# EAGLE design And_Or (EAGLE 7.6.0)
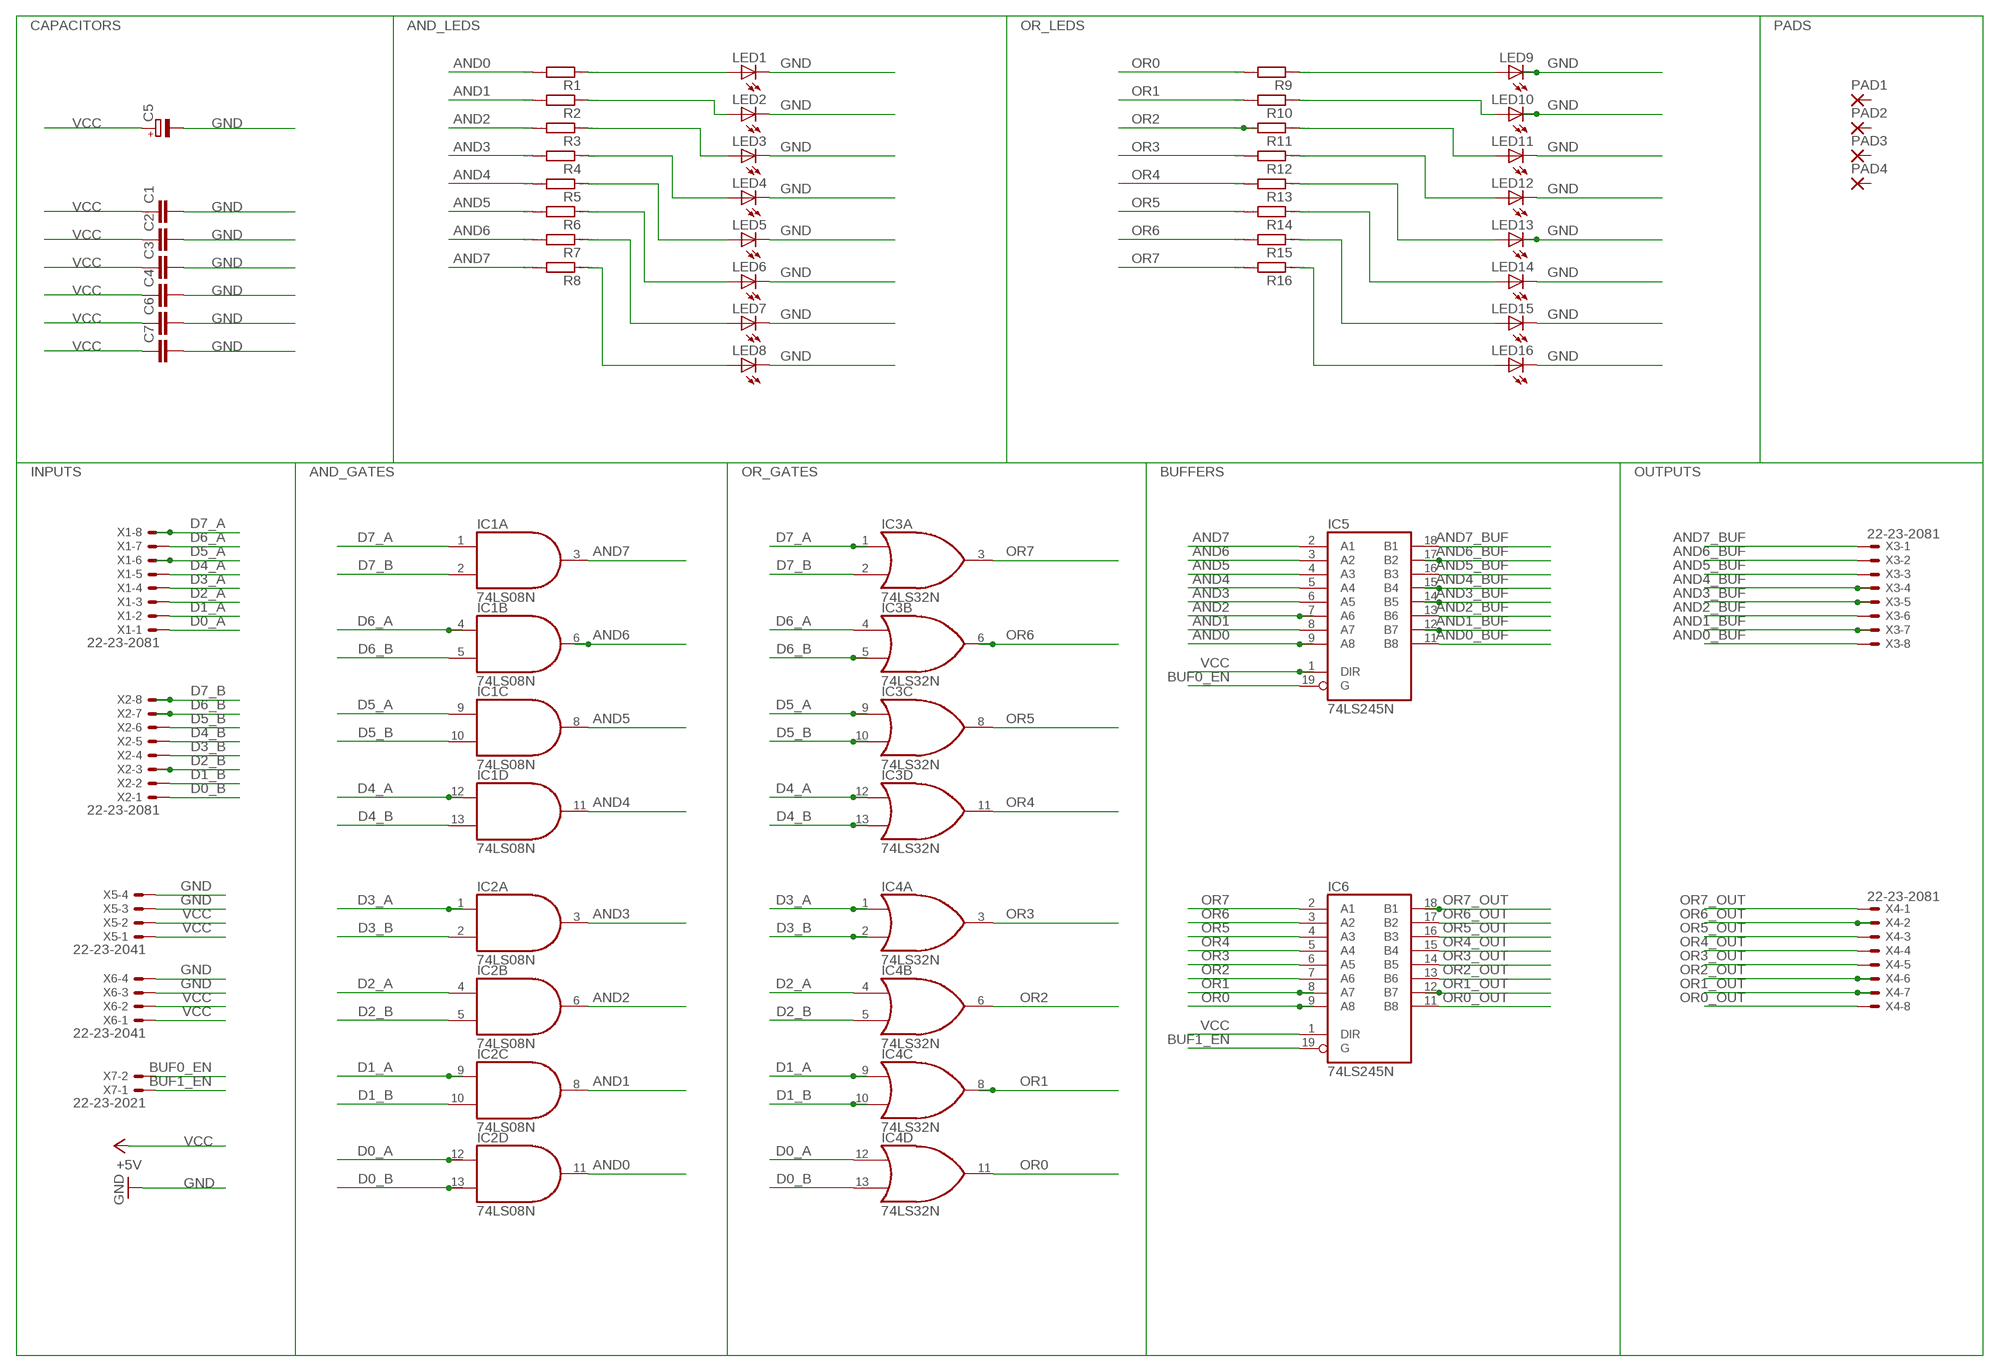
[diagram p0: schematic, sheet 1]

## Parts
C1  C-EU025-025X050  [C025-025X050]
C2  C-EU025-025X050  [C025-025X050]
C3  C-EU025-025X050  [C025-025X050]
C4  C-EU025-025X050  [C025-025X050]
C5  CPOL-EUE2,5-6E  [E2,5-6E]
C6  C-EU025-025X050  [C025-025X050]
C7  C-EU025-025X050  [C025-025X050]
IC1  74LS08N  [DIL14]
IC2  74LS08N  [DIL14]
IC3  74LS32N  [DIL14]
IC4  74LS32N  [DIL14]
IC5  74LS245N  [DIL20]
IC6  74LS245N  [DIL20]
LED1  LED5MM  [LED5MM]
LED2  LED5MM  [LED5MM]
LED3  LED5MM  [LED5MM]
LED4  LED5MM  [LED5MM]
LED5  LED5MM  [LED5MM]
LED6  LED5MM  [LED5MM]
LED7  LED5MM  [LED5MM]
LED8  LED5MM  [LED5MM]
LED9  LED5MM  [LED5MM]
LED10  LED5MM  [LED5MM]
LED11  LED5MM  [LED5MM]
LED12  LED5MM  [LED5MM]
LED13  LED5MM  [LED5MM]
LED14  LED5MM  [LED5MM]
LED15  LED5MM  [LED5MM]
LED16  LED5MM  [LED5MM]
PAD1  3,17/1,3  [3,17/1,3]
PAD2  3,17/1,3  [3,17/1,3]
PAD3  3,17/1,3  [3,17/1,3]
PAD4  3,17/1,3  [3,17/1,3]
R1  R0207/10  [0207/10]
R2  R0207/10  [0207/10]
R3  R0207/10  [0207/10]
R4  R0207/10  [0207/10]
R5  R0207/10  [0207/10]
R6  R0207/10  [0207/10]
R7  R0207/10  [0207/10]
R8  R0207/10  [0207/10]
R9  R0207/10  [0207/10]
R10  R0207/10  [0207/10]
R11  R0207/10  [0207/10]
R12  R0207/10  [0207/10]
R13  R0207/10  [0207/10]
R14  R0207/10  [0207/10]
R15  R0207/10  [0207/10]
R16  R0207/10  [0207/10]
X1  22-23-2081  [22-23-2081]
X2  22-23-2081  [22-23-2081]
X3  22-23-2081  [22-23-2081]
X4  22-23-2081  [22-23-2081]
X5  22-23-2041  [22-23-2041]
X6  22-23-2041  [22-23-2041]
X7  22-23-2021  [22-23-2021]

## Nets
AND0: IC2.11(D:O) IC5.9(A8) R1.2
AND0_BUF: IC5.11(B8) X3.8
AND1: IC2.8(C:O) IC5.8(A7) R2.2
AND1_BUF: IC5.12(B7) X3.7
AND2: IC2.6(B:O) IC5.7(A6) R3.2
AND2_BUF: IC5.13(B6) X3.6
AND3: IC2.3(A:O) IC5.6(A5) R4.2
AND3_BUF: IC5.14(B5) X3.5
AND4: IC1.11(D:O) IC5.5(A4) R5.2
AND4_BUF: IC5.15(B4) X3.4
AND5: IC1.8(C:O) IC5.4(A3) R6.2
AND5_BUF: IC5.16(B3) X3.3
AND6: IC1.6(B:O) IC5.3(A2) R7.2
AND6_BUF: IC5.17(B2) X3.2
AND7: IC1.3(A:O) IC5.2(A1) R8.2
AND7_BUF: IC5.18(B1) X3.1
BUF0_EN: IC5.19(G) X7.2
BUF1_EN: IC6.19(G) X7.1
D0_A: IC2.12(D:I0) IC4.12(D:I0) X1.1
D0_B: IC2.13(D:I1) IC4.13(D:I1) X2.1
D1_A: IC2.9(C:I0) IC4.9(C:I0) X1.2
D1_B: IC2.10(C:I1) IC4.10(C:I1) X2.2
D2_A: IC2.4(B:I0) IC4.4(B:I0) X1.3
D2_B: IC2.5(B:I1) IC4.5(B:I1) X2.3
D3_A: IC2.1(A:I0) IC4.1(A:I0) X1.4
D3_B: IC2.2(A:I1) IC4.2(A:I1) X2.4
D4_A: IC1.12(D:I0) IC3.12(D:I0) X1.5
D4_B: IC1.13(D:I1) IC3.13(D:I1) X2.5
D5_A: IC1.9(C:I0) IC3.9(C:I0) X1.6
D5_B: IC1.10(C:I1) IC3.10(C:I1) X2.6
D6_A: IC1.4(B:I0) IC3.4(B:I0) X1.7
D6_B: IC1.5(B:I1) IC3.5(B:I1) X2.7
D7_A: IC1.1(A:I0) IC3.1(A:I0) X1.8
D7_B: IC1.2(A:I1) IC3.2(A:I1) X2.8
GND [supply]: C1.2 C2.2 C3.2 C4.2 C5.- C6.2 C7.2 LED1.K(C) LED2.K(C) LED3.K(C) LED4.K(C) LED5.K(C) LED6.K(C) LED7.K(C) LED8.K(C) LED9.K(C) LED10.K(C) LED11.K(C) LED12.K(C) LED13.K(C) LED14.K(C) LED15.K(C) LED16.K(C) X5.3 X5.4 X6.3 X6.4
N$35: LED1.A R1.1
N$36: LED2.A R2.1
N$37: LED3.A R3.1
N$38: LED4.A R4.1
N$39: LED5.A R5.1
N$40: LED6.A R6.1
N$41: LED8.A R8.1
N$42: LED7.A R7.1
N$59: LED16.A R16.1
N$60: LED15.A R15.1
N$61: LED14.A R14.1
N$62: LED13.A R13.1
N$63: LED12.A R12.1
N$64: LED11.A R11.1
N$65: LED10.A R10.1
N$66: LED9.A R9.1
OR0: IC4.11(D:O) IC6.9(A8) R9.2
OR0_OUT: IC6.11(B8) X4.8
OR1: IC4.8(C:O) IC6.8(A7) R10.2
OR1_OUT: IC6.12(B7) X4.7
OR2: IC4.6(B:O) IC6.7(A6) R11.2
OR2_OUT: IC6.13(B6) X4.6
OR3: IC4.3(A:O) IC6.6(A5) R12.2
OR3_OUT: IC6.14(B5) X4.5
OR4: IC3.11(D:O) IC6.5(A4) R13.2
OR4_OUT: IC6.15(B4) X4.4
OR5: IC3.8(C:O) IC6.4(A3) R14.2
OR5_OUT: IC6.16(B3) X4.3
OR6: IC3.6(B:O) IC6.3(A2) R15.2
OR6_OUT: IC6.17(B2) X4.2
OR7: IC3.3(A:O) IC6.2(A1) R16.2
OR7_OUT: IC6.18(B1) X4.1
VCC [supply]: C1.1 C2.1 C3.1 C4.1 C5.+ C6.1 C7.1 IC5.1(DIR) IC6.1(DIR) X5.1 X5.2 X6.1 X6.2 ; supply symbol labelled +5V
Unconnected: PAD1.1(P) PAD2.1(P) PAD3.1(P) PAD4.1(P)

## Notes on the sheet
- CAPACITORS | AND_LEDS | OR_LEDS | PADS
- INPUTS | AND_GATES | OR_GATES | BUFFERS | OUTPUTS

## Power pins joined to a net without a drawn wire
GND: IC1.7(P:GND) IC2.7(P:GND) IC3.7(P:GND) IC4.7(P:GND) IC5.10(GND) IC6.10(GND)
VCC: IC1.14(P:VCC) IC2.14(P:VCC) IC3.14(P:VCC) IC4.14(P:VCC) IC5.20(VCC) IC6.20(VCC)

## Library data of the parts
C1-C4 C6 C7 = rcl:C-EU: CAPACITOR, European symbol
C5 = rcl:CPOL-EU: POLARIZED CAPACITOR, European symbol
IC1 IC2 = 74xx-us:74*08: Quad 2-input AND gate
IC3 IC4 = 74xx-us:74*32: Quad 2-input OR gate
IC5 IC6 = 74xx-us:74*245: Octal BUS TRANSCEIVER, 3-state
LED1-LED16 = led:LED: LED OSRAM: - CHIPLED LG R971, LG N971, LY N971, LG Q971, LY Q971, LO R971, LY R971 LH N974, LH R974 LS Q976, LO Q976, LY Q976 LO Q996 - Hyper CHIPLED LW Q18S LB Q993, LB Q99A, LB R99A - SideLED LS A670, LO A670, LY A670, LG A670, LP A670 LB A673, LV A673, LT A673, LW A673 LH A674 LY A675 LS A676, LA A676, LO A676, LY A676, LW A676 LS A679, LY A679, LG A679 - Hyper Micro SIDELED® LS Y876, LA Y876, LO Y876, LY Y876 LT Y87S - SmartLED LW L88C, LW L88S LB L89C, LB L89S, LG L890 LS L89K, LO L89K, LY L89K LS L896, LA L896, LO L896, LY L896 - TOPLED LS T670, LO T670, LY T670, LG T670, LP T670 LSG T670, LSP T670, LSY T670, LOP T670, LYG T670 LG T671, LOG T671, LSG T671 LB T673, LV T673, LT T673, LW T673 LH T674 LS T676, LA T676, LO T676, LY T676, LB T676, LH T676, LSB T676, LW T676 LB T67C, LV T67C, LT T67C, LS T67K, LO T67K, LY T67K, LW E67C LS E67B, LA E67B, LO E67B, LY E67B, LB E67C, LV E67C, LT E67C LW T67C LS T679, LY T679, LG T679 LS T770, LO T770, LY T770, LG T770, LP T770 LB T773, LV T773, LT T773, LW T773 LH T774 LS E675, LA E675, LY E675, LS T675 LS T776, LA T776, LO T776, LY T776, LB T776 LHGB T686 LT T68C, LB T68C - Hyper Mini TOPLED® LB M676 - Mini TOPLED Santana® LG M470 LS M47K, LO M47K, LY M47K Source: http://www.osram.convergy.de LUXEON: - LUMILED® LXK2-PW12-R00, LXK2-PW12-S00, LXK2-PW14-U00, LXK2-PW14-V00 LXK2-PM12-R00, LXK2-PM12-S00, LXK2-PM14-U00 LXK2-PE12-Q00, LXK2-PE12-R00, LXK2-PE12-S00, LXK2-PE14-T00, LXK2-PE14-U00 LXK2-PB12-K00, LXK2-PB12-L00, LXK2-PB12-M00, LXK2-PB14-N00, LXK2-PB14-P00, LXK2-PB14-Q00 LXK2-PR12-L00, LXK2-PR12-M00, LXK2-PR14-Q00, LXK2-PR14-R00 LXK2-PD12-Q00, LXK2-PD12-R00, LXK2-PD12-S00 LXK2-PH12-R00, LXK2-PH12-S00 LXK2-PL12-P00, LXK2-PL12-Q00, LXK2-PL12-R00 Source: www.luxeon.com KINGBRIGHT: KA-3528ASYC Source: www.kingbright.com
PAD1-PAD4 = wirepad:3,17/1,3: THROUGH-HOLE PAD
R1-R16 = eagle-ltspice:R: RESISTOR, European symbol; SPICEMODEL: NONE; SPICEPREFIX: R
X1-X4 = con-molex:22-23-2081: .100" (2.54mm) Center Header - 8 Pin; MF: MOLEX; MPN: 22-23-2081; OC_FARNELL: 1756826; OC_NEWARK: 01C7592
X5 X6 = con-molex:22-23-2041: .100" (2.54mm) Center Header - 4 Pin; MF: MOLEX; MPN: 22-23-2041; OC_FARNELL: 1462920; OC_NEWARK: 38C0355
X7 = con-molex:22-23-2021: .100" (2.54mm) Center Header - 2 Pin; MF: MOLEX; MPN: 22-23-2021; OC_FARNELL: 1462926; OC_NEWARK: 25C3832

## Net classes
1 supply: width 0.889 mm

## Board
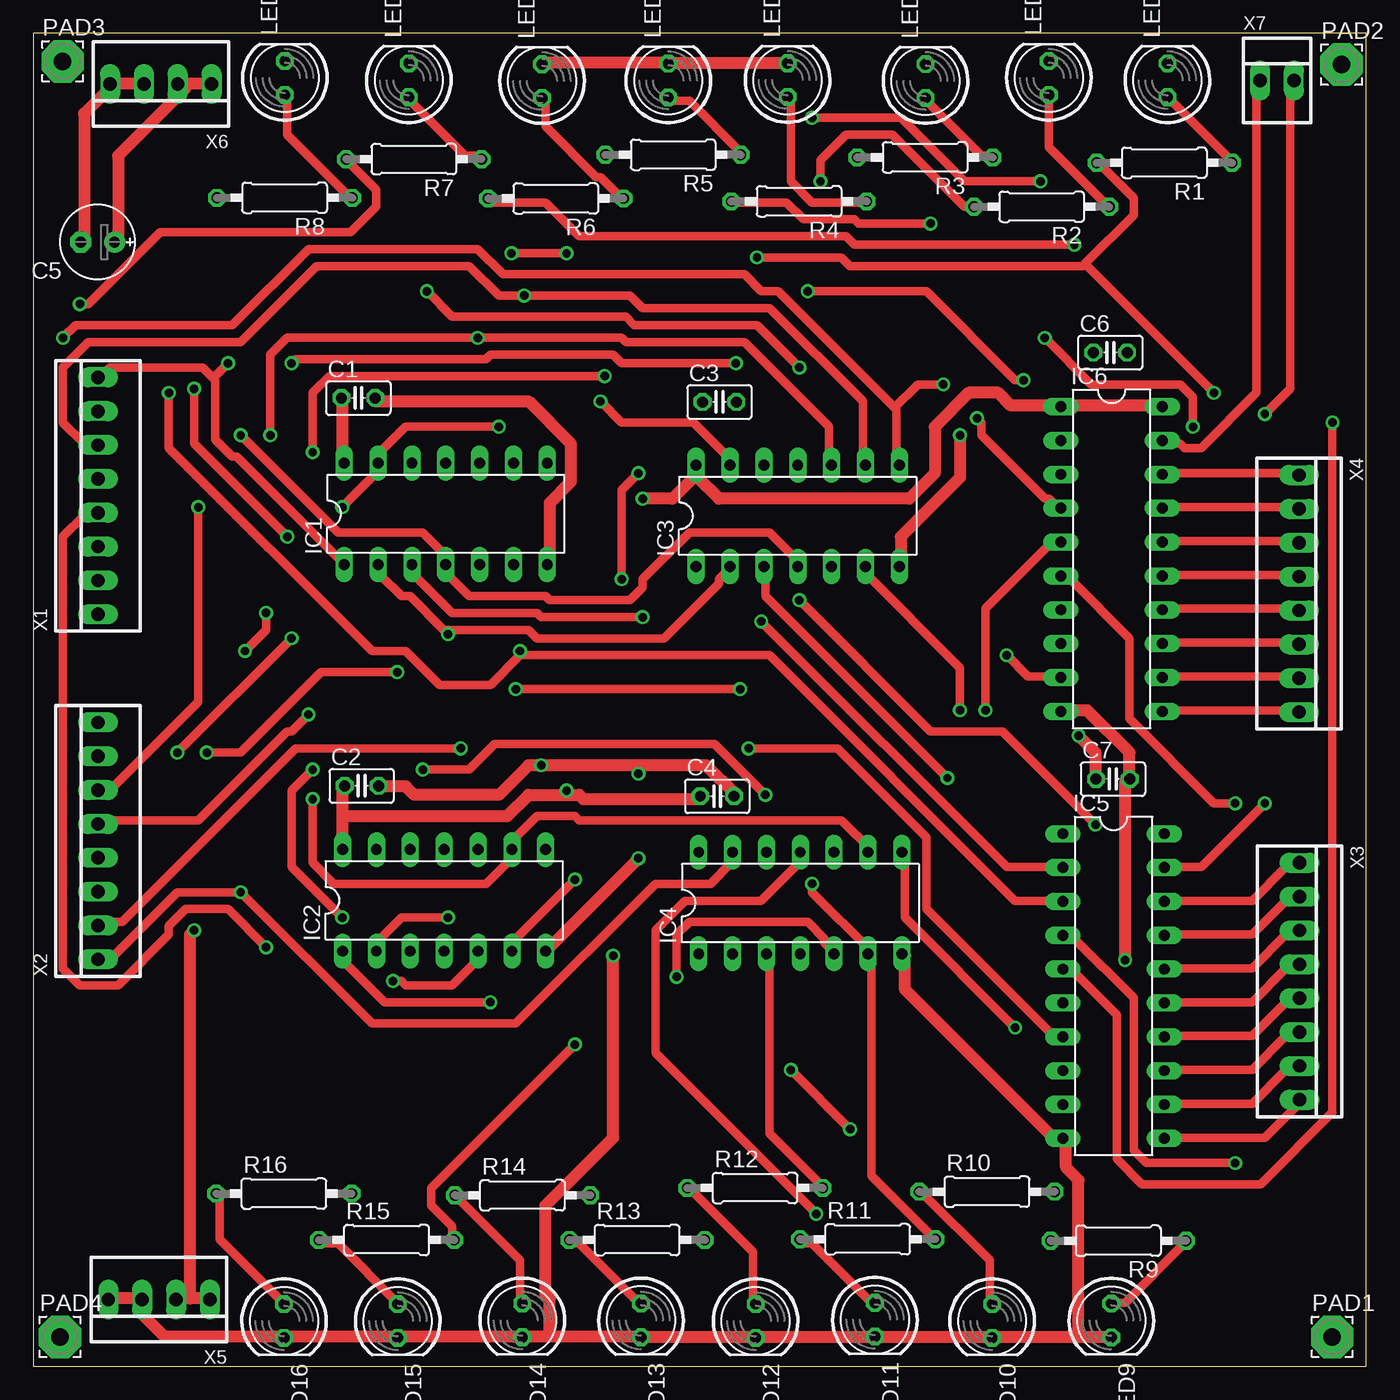
[diagram p1: board, top side]
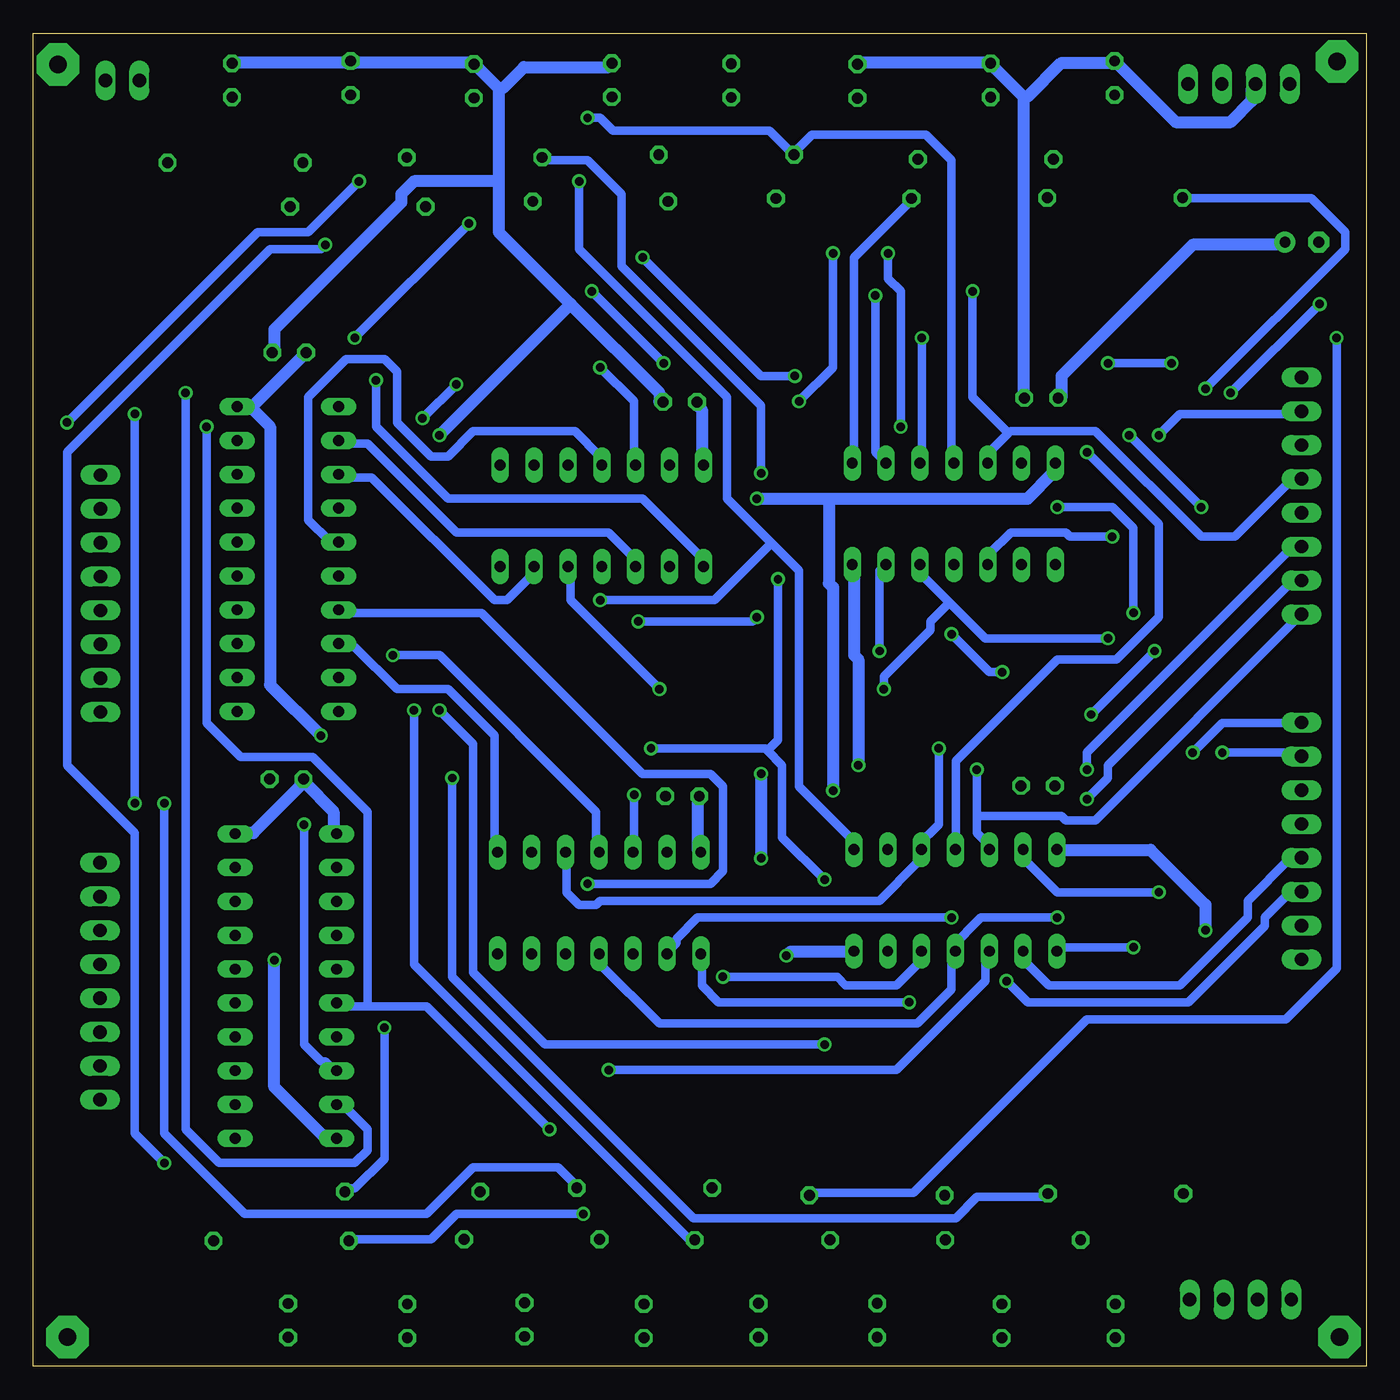
[diagram p2: board, bottom side, seen from below]

Size 100 x 100 mm. Coordinates in mm from the lower left corner, seen from the top.
Outline: 0,0 100,0 100,100 0,100 0,0
Copper layers (1*16): Top 0.035mm / dielectric 1.5mm / Bottom 0.035mm
Design rules "default *": minimum track width 25mil, minimum drill 25mil, track to track 25mil, track to pad 25mil, pad to pad 25mil, via to via 25mil, smd to smd 8mil, copper to edge 40mil, drill to drill 8mil, minimum pad ring 10mil, minimum via ring 8mil, stop-mask expansion 4mil, vias tented up to drill 0mil, thermal gap 10mil

### Footprints (pad centres in the part's own frame; a part is rotated, then mirrored left to right if it is on the bottom)
C025-025X050 = drill 0.813 octagon: 1 -1.27,0; 2 1.27,0
E2,5-6E = drill 0.813 pad 1.575: + -1.27,0 | drill 0.813 pad 1.575 octagon: - 1.27,0
DIL14 = drill 0.813 long: 1 -7.62,-3.81; 2 -5.08,-3.81; 3 -2.54,-3.81; 4 0,-3.81; 5 2.54,-3.81; 6 5.08,-3.81; 7 7.62,-3.81; 8 7.62,3.81; 9 5.08,3.81; 10 2.54,3.81; 11 0,3.81; 12 -2.54,3.81; 13 -5.08,3.81; 14 -7.62,3.81
DIL20 = drill 0.813 long: 1 -11.43,-3.81; 2 -8.89,-3.81; 3 -6.35,-3.81; 4 -3.81,-3.81; 5 -1.27,-3.81; 6 1.27,-3.81; 7 3.81,-3.81; 8 6.35,-3.81; 9 8.89,-3.81; 10 11.43,-3.81; 11 11.43,3.81; 12 8.89,3.81; 13 6.35,3.81; 14 3.81,3.81; 15 1.27,3.81; 16 -1.27,3.81; 17 -3.81,3.81; 18 -6.35,3.81; 19 -8.89,3.81; 20 -11.43,3.81
LED5MM = drill 0.813 octagon: A -1.27,0; K 1.27,0
3,17/1,3 = drill 1.321 pad 3.175 octagon: 1 0,0
0207/10 = drill 0.813 octagon: 1 -5.08,0; 2 5.08,0
22-23-2081 = drill 1 long: 1 -8.89,0; 2 -6.35,0; 3 -3.81,0; 4 -1.27,0; 5 1.27,0; 6 3.81,0; 7 6.35,0; 8 8.89,0
22-23-2041 = drill 1 long: 1 -3.81,0; 2 -1.27,0; 3 1.27,0; 4 3.81,0
22-23-2021 = drill 1 long: 1 -1.27,0; 2 1.27,0

### Placement (x,y rotation side)
C1  24.38,72.64 0 top
C2  24.63,43.54 0 top
C3  51.48,72.34 0 top
C4  51.31,42.76 0 top
C5  4.82,84.34 180 top
C6  80.8,76.05 0 top
C7  81,44.05 0 top
IC1  30.94,63.95 0 top
IC2  30.82,34.95 0 top
IC3  57.35,63.8 0 top
IC4  57.54,34.75 0 top
IC5  81.05,28.52 270 top
IC6  80.9,60.56 270 top
LED1  85.09,96.48 90 top
LED2  76.19,96.65 90 top
LED3  66.94,96.42 90 top
LED4  56.59,96.49 90 top
LED5  47.64,96.46 90 top
LED6  38.17,96.41 90 top
LED7  28.17,96.48 90 top
LED8  18.87,96.65 90 top
LED9  80.88,3.43 270 top
LED10  71.94,3.39 270 top
LED11  63.14,3.49 270 top
LED12  54.19,3.39 270 top
LED13  45.59,3.44 270 top
LED14  36.69,3.44 270 top
LED15  27.34,3.39 270 top
LED16  18.81,3.39 270 top
PAD1  97.45,2.2 0 top
PAD2  98.15,97.65 0 top
PAD3  2.2,97.9 0 top
PAD4  2,2.2 0 top
R1  84.85,90.29 180 top
R2  75.65,86.99 180 top
R3  66.9,90.69 180 top
R4  57.45,87.39 180 top
R5  48,90.89 180 top
R6  39.2,87.61 180 top
R7  28.55,90.56 180 top
R8  18.85,87.66 180 top
R9  81.4,9.41 180 top
R10  71.55,13.09 0 top
R11  62.6,9.52 0 top
R12  54.15,13.37 0 top
R13  45.3,9.47 0 top
R14  36.7,12.82 0 top
R15  26.5,9.47 0 top
R16  18.8,12.95 0 top
X1  4.85,65.3 90 top
X2  4.85,39.41 90 top
X3  95,28.88 270 top
X4  94.95,57.97 270 top
X5  9.43,5 180 top
X6  9.56,96.2 180 top
X7  93.31,96.45 0 top

### Tracks (layer width: path | path; a pad name or v marks a point on that pad's centre or on a via)
AND0  (via drill 0.64)
  Top 0.635: v20.95,68.58 20.95,73.03 22.23,74.3 v42.86,74.3 | v54.29,83.19 60.64,83.19 61.28,82.55 78.74,82.55 78.9,82.71 | 78.9,82.71 82.55,86.36 82.55,87.63 80.01,90.17 R1.2 | 78.9,82.71 v88.58,73.03
  Bottom 0.635: v20.95,68.58 15.56,63.18 15.56,56.2 18.73,53.02 23.18,53.02 30.8,45.4 30.8,39.05 IC2.11 | v42.86,74.3 45.4,74.3 v54.29,83.19 | v88.58,73.03 88.58,17.78 86.04,15.24 75.88,15.24 74.93,16.19 74.93,17.78 76.52,19.37 77.15,19.37 IC5.9
AND0_BUF
  Top 0.635: IC5.11 85.09,17.14 92.39,17.14 94.93,19.68 X3.8
AND1  (via drill 0.64)
  Top 0.635: v59.05,88.9 59.05,90.49 60.96,92.39 64.45,92.39 69.85,87 70.48,87 R2.2 | v79.69,40.64 72.71,47.62 67.31,47.62 v57.47,57.47
  Bottom 0.635: 44.61,61.75 47.94,65.09 47.94,72.71 59.05,83.82 v59.05,88.9 | 44.61,61.75 42.55,59.69 42.55,43.5 38.73,39.69 38.73,39.05 IC2.8 | v79.69,40.64 79.69,24.13 78.42,22.86 78.11,22.86 77.47,22.23 IC5.8 | v57.47,57.47 48.9,57.47 44.61,61.75
AND1_BUF
  Top 0.635: IC5.12 85.09,19.68 91.44,19.68 93.98,22.23 94.93,22.23 X3.7
AND2  (via drill 0.64)
  Top 0.635: v53.66,46.35 60.33,46.35 66.99,39.69 66.99,34.29 76.52,24.77 77.15,24.77 IC5.7 | v40.64,36.51 36.2,32.07 36.2,31.43 IC2.6 | v45.4,66.99 44.13,65.72 v44.13,59.05
  Bottom 0.635: v53.66,46.35 45.09,46.35 44.93,46.2 | 44.93,46.2 43.81,45.09 43.81,39.69 v40.64,36.51 | v45.4,66.99 45.4,72.07 55.88,82.55 55.88,87.95 58.42,90.49 61.59,90.49 R3.2 | v44.13,59.05 44.13,46.99 44.93,46.2
AND2_BUF
  Top 0.635: IC5.13 85.09,22.23 91.44,22.23 93.98,24.77 94.93,24.77 X3.6
AND3  (via drill 0.64)
  Top 0.635: v56.83,22.23 v61.28,17.78 | v67.31,85.72 61.91,85.72 61.59,86.04 57.78,86.04 56.52,87.31 52.39,87.31 R4.2 | v75.88,77.15 79.38,73.66 86.04,73.66 87,72.71 v87,70.48
  Bottom 0.635: 74.93,26.99 70.48,26.99 v61.28,17.78 | 74.93,26.99 77.15,26.99 IC5.6 | v56.83,22.23 35.24,22.23 28.57,28.89 28.57,31.11 IC2.3 | v75.88,77.15 v67.31,85.72 | v87,70.48 87,48.26 84.45,45.72 79.06,45.72 74.93,41.59 74.93,26.99
AND3_BUF
  Top 0.635: IC5.14 85.09,24.77 91.44,24.77 93.98,27.3 94.93,27.3 X3.5
AND4  (via drill 0.64)
  Top 0.635: v97.47,70.8 97.47,19.05 92.08,13.65 83.19,13.65 81.28,15.56 81.28,26.35 78.11,29.53 77.47,29.53 IC5.5 | v75.56,88.9 69.85,88.9 65.09,93.66 v58.42,93.66
  Bottom 0.635: IC1.11 31.11,67.94 31.11,90.49 33.02,92.39 41.59,92.39 42.86,91.12 R5.2 43.18,91.12 44.77,92.71 56.52,92.71 57.47,93.66 v58.42,93.66 | v97.47,70.8 83.19,85.09 79.38,85.09 v75.56,88.9
AND4_BUF
  Top 0.635: IC5.15 85.09,27.3 91.44,27.3 93.98,29.84 94.93,29.84 X3.4
AND5  (via drill 0.64)
  Top 0.635: v90.17,15.24 83.5,15.24 82.55,16.19 82.55,27.62 78.11,32.07 77.47,32.07 IC5.4 | v78.11,84.14 61.59,84.14 60.96,84.77 40.96,84.77 38.42,87.31 34.29,87.31 R6.2
  Bottom 0.635: IC1.8 38.42,67.94 38.42,83.19 34.29,87.31 R6.2 | v90.17,15.24 92.39,17.46 92.39,40.01 97.47,45.09 97.47,68.58 82.23,83.82 78.42,83.82 v78.11,84.14
AND5_BUF
  Top 0.635: IC5.16 85.09,29.84 91.44,29.84 93.98,32.38 94.93,32.38 X3.3
AND6  (via drill 0.64)
  Top 0.635: IC5.3 77.15,34.92 73.66,34.92 55.24,53.34 36.83,53.34 v36.51,53.66 36.51,53.34 34.29,51.12 30.48,51.12 27.94,53.66 25.4,53.66 10.16,68.9 v10.16,73.03 | v3.49,79.69 4.13,79.69 9.53,85.09 23.81,85.09 25.72,87 25.72,88.27 23.5,90.49 R7.2
  Bottom 0.635: v36.51,53.66 36.51,59.69 36.2,60.01 IC1.6 | v10.16,73.03 v3.49,79.69
AND6_BUF
  Top 0.635: IC5.17 85.09,32.38 91.44,32.38 93.98,34.92 94.93,34.92 X3.2
AND7  (via drill 0.64)
  Top 0.635: v54.61,55.88 73.03,37.47 77.15,37.47 IC5.2 | v45.72,56.2 38.1,56.2 37.78,56.52 31.43,56.52 28.57,59.37 28.57,60.01 IC1.3 | v12.06,73.34 12.06,69.22 v19.05,62.23
  Bottom 0.635: v54.61,55.88 46.04,55.88 v45.72,56.2 | v12.06,73.34 1.59,83.82 1.59,85.09 4.13,87.63 13.65,87.63 R8.2 | v19.05,62.23 22.23,62.23 22.54,62.55 26.67,62.55 28.26,60.96 28.26,60.33 IC1.3
AND7_BUF
  Top 0.635: IC5.18 85.09,34.92 91.44,34.92 93.98,37.47 94.93,37.47 X3.1
BUF0_EN  (via drill 0.64)
  Top 0.635: v92.39,42.23 87.63,37.47 85.09,37.47 IC5.19 | v92.39,71.44 94.3,73.34 94.3,96.2 X7.2
  Bottom 0.635: v92.39,71.44 v92.39,42.23
BUF1_EN
  Top 0.635: IC6.19 84.77,69.22 86.04,69.22 86.36,68.9 87.63,68.9 91.76,73.03 91.76,96.2 X7.1
D0_A  (via drill 0.64)
  Top 0.635: v54.93,42.86 51.12,46.67 34.61,46.67 32.7,44.77 v29.21,44.77
  Bottom 0.635: v54.93,42.86 54.93,38.73 IC4.12 | 29.21,41.27 29.21,40.01 28.26,39.05 IC2.12 | 29.21,41.27 v29.21,44.77 | 29.21,41.27 22.86,41.27 22.54,40.96 20.32,40.96 5.08,56.2 X1.1
D0_B  (via drill 0.64)
  Top 0.635: X2.1 5.08,30.8 6.03,30.8 10.79,35.56 v15.56,35.56 25.4,25.72 36.2,25.72 46.67,36.2 50.8,36.2 52.39,37.78 52.39,38.42 IC4.13
  Bottom 0.635: v15.56,35.56 23.18,35.56 25.72,38.1 25.72,38.73 IC2.13
D1_A  (via drill 0.64)
  Top 0.635: IC4.9 62.87,38.73 60.64,40.96 40.96,40.96 40.64,41.27 37.78,41.27 36.2,39.69 36.2,39.05 IC2.9 35.88,38.73 35.88,38.1 33.97,36.2 22.54,36.2 20.95,37.78 v20.95,42.55
  Bottom 0.635: v20.95,42.55 19.37,44.13 19.37,45.09 5.71,58.74 5.08,58.74 X1.2
D1_B  (via drill 0.64)
  Top 0.635: v32.07,46.35 19.68,46.35 6.67,33.34 5.08,33.34 X2.2
  Bottom 0.635: IC4.10 60.01,38.42 60.01,35.56 59.05,34.61 57.78,34.61 57.47,34.92 36.51,34.92 33.66,37.78 33.66,38.73 IC2.10 33.66,39.05 32.07,40.64 v32.07,46.35
D2_A  (via drill 0.64)
  Top 0.635: v20.95,44.77 19.37,43.18 19.37,37.47 v23.18,33.66
  Bottom 0.635: IC4.4 57.47,30.8 57.47,30.16 53.02,25.72 33.66,25.72 31.11,28.26 31.11,31.11 IC2.4 31.11,31.43 28.89,33.66 v23.18,33.66 | v20.95,44.77 20.95,46.04 5.71,61.28 5.08,61.28 X1.3
D2_B  (via drill 0.64)
  Top 0.635: v48.26,29.21 48.26,32.38 49.21,33.34 58.1,33.34 59.37,32.07 59.37,31.75 60.01,31.11 IC4.5 | v26.99,28.89 27.62,28.89 27.94,28.57 31.43,28.57 33.34,30.48 33.34,31.11 IC2.5
  Bottom 0.635: v48.26,29.21 39.69,29.21 39.05,28.57 35.24,28.57 33.66,30.16 33.66,31.11 IC2.5 | v26.99,28.89 25.4,27.3 13.34,27.3 7.62,33.02 7.62,33.66 5.71,35.56 5.08,35.56 X2.3
D3_A  (via drill 0.64)
  Top 0.635: v34.29,27.3 26.35,27.3 23.5,30.16 23.5,31.11 IC2.1 | v17.46,31.43 14.61,34.29 11.43,34.29 10.16,33.02 10.16,32.38 6.35,28.57 3.49,28.57 2.22,29.84 2.22,62.23 3.81,63.82 4.76,63.82 X1.4
  Bottom 0.635: v34.29,27.3 48.58,27.3 49.85,28.57 49.85,30.8 IC4.1 | v17.46,31.43 23.18,31.43 IC2.1
D3_B  (via drill 0.64)
  Top 0.635: v31.11,33.66 27.62,33.66 26.04,32.07 26.04,31.43 IC2.2
  Bottom 0.635: IC2.2 25.72,31.11 25.72,30.48 23.81,28.57 13.97,28.57 8.89,33.66 8.89,34.92 5.71,38.1 5.08,38.1 X2.4 | v31.11,33.66 50.16,33.66 51.75,32.07 51.75,31.75 52.39,31.11 IC4.2
D4_A  (via drill 0.64)
  Top 0.635: v57.47,74.93 54.29,78.11 45.09,78.11 44.45,78.74 31.43,78.74 v29.53,80.64
  Bottom 0.635: 26.83,70.01 26.67,70.17 20.32,70.17 12.38,62.23 9.84,62.23 5.71,66.36 5.08,66.36 X1.5 | 26.83,70.01 28.26,68.58 28.26,67.94 IC1.12 | v57.47,74.93 54.93,72.39 54.93,67.63 IC3.12 | v29.53,80.64 29.53,72.71 26.83,70.01
D4_B  (via drill 0.64)
  Top 0.635: v23.18,64.45 25.72,66.99 25.72,67.63 IC1.13 26.04,67.94 26.04,68.58 27.94,70.48 v34.92,70.48 | v17.46,56.52 17.46,55.24 v15.88,53.66 | v20.64,48.9 19.37,47.62 19.05,47.62 12.38,40.96 5.08,40.96 X2.5 | v42.55,72.39 44.13,70.8 49.53,70.8 52.07,68.26 52.07,67.63 IC3.13 | v35.88,83.5 v40.01,83.5
  Bottom 0.635: v23.18,64.45 19.05,64.45 17.46,62.87 v17.46,56.52 | v20.64,48.9 v15.88,53.66 | v42.55,72.39 40.01,74.93 v40.01,83.5 | v35.88,83.5 35.88,81.6 34.92,80.64 v34.92,70.48
D5_A  (via drill 0.64)
  Top 0.635: IC3.9 62.23,67.63 62.23,72.39 55.24,79.38 45.72,79.38 44.77,80.33 v36.83,80.33 34.92,80.33 32.7,82.55 21.27,82.55 15.56,76.83 4.13,76.83 2.22,74.93 2.22,70.8 3.81,69.22 4.76,69.22 X1.6
  Bottom 0.635: v36.83,80.33 36.83,68.58 36.2,67.94 IC1.9
D5_B  (via drill 0.64)
  Top 0.635: IC3.10 59.69,67.63 59.69,70.48 53.34,76.83 44.45,76.83 44.13,77.15 v33.34,77.15 19.05,77.15 17.78,75.88 v17.78,69.85 | v12.38,64.45 12.38,49.85 6.03,43.5 5.08,43.5 X2.6
  Bottom 0.635: v33.34,77.15 33.34,67.94 IC1.10 | v17.78,69.85 v12.38,64.45
D6_A  (via drill 0.64)
  Top 0.635: IC3.4 57.15,60.01 57.15,60.64 55.24,62.55 49.21,62.55 45.72,59.05 45.72,58.42 44.77,57.47 38.73,57.47 38.42,57.78 32.7,57.78 31.11,59.37 31.11,60.01 IC1.4 30.8,60.33 30.8,60.96 29.21,62.55 22.86,62.55 v15.56,69.85
  Bottom 0.635: v15.56,69.85 13.97,71.44 5.08,71.44 X1.7
D6_B  (via drill 0.64)
  Top 0.635: v10.79,46.04 v19.37,54.61 | v36.2,50.8 v53.02,50.8
  Bottom 0.635: 31.27,57.31 28.57,54.61 v19.37,54.61 | 31.27,57.31 33.34,59.37 33.34,60.01 IC1.5 | v10.79,46.04 5.08,46.04 X2.7 | v53.02,50.8 59.69,57.47 59.69,59.69 IC3.5 | v36.2,50.8 36.2,51.75 32.7,55.24 32.7,55.88 31.27,57.31
D7_A  (via drill 0.64)
  Top 0.635: 13.49,74.14 12.7,74.93 5.71,74.93 5.08,74.3 X1.8 | 13.49,74.14 13.65,73.98 13.65,69.53 14.92,68.26 15.24,68.26 23.18,60.33 IC1.1 | v74.3,73.98 73.66,73.98 66.99,80.64 v58.1,80.64 | v52.7,75.25 44.13,75.25 43.5,75.88 34.29,75.88 33.97,75.56 19.68,75.56 v19.37,75.25 | 13.49,74.14 v14.61,75.25
  Bottom 0.635: v74.3,73.98 74.3,70.48 68.9,65.09 54.29,65.09 49.85,60.64 49.85,60.01 IC3.1 | v52.7,75.25 v58.1,80.64 | v14.61,75.25 v19.37,75.25
D7_B  (via drill 0.64)
  Top 0.635: 31.11,55.24 30.8,55.24 28.26,57.78 27.62,57.78 26.04,59.37 26.04,60.01 IC1.2 | 31.11,55.24 37.15,55.24 37.78,54.61 47.31,54.61 51.44,58.74 51.44,59.05 52.07,59.69 IC3.2 | v13.02,46.04 15.56,46.04 21.59,52.07 v27.3,52.07 | 31.11,55.24 v31.11,54.93
  Bottom 0.635: v13.02,46.04 10.79,48.26 5.08,48.26 X2.8 | v27.3,52.07 28.26,52.07 v31.11,54.93
GND  (via drill 0.64)
  Top 0.889: X5.4 5.71,5.08 7.94,5.08 X5.3 8.26,4.76 8.26,3.81 9.84,2.22 18.41,2.22 LED16.K 19.05,2.22 27.3,2.22 LED15.K 27.62,2.22 36.51,2.22 LED14.K 36.83,2.22 38.73,2.22 | IC6.10 77.15,49.21 79.06,49.21 82.23,46.04 82.23,44.13 C7.2 81.92,43.81 v81.92,30.48 | 38.73,2.22 45.4,2.22 LED13.K 46.04,2.22 53.98,2.22 LED12.K 54.61,2.22 62.87,2.22 LED11.K 63.5,2.22 71.75,2.22 LED10.K 72.07,2.22 78.42,2.22 | v43.5,30.8 43.5,17.14 38.42,12.06 38.42,5.4 38.73,5.08 38.73,2.22 | 78.42,2.22 80.64,2.22 LED9.K | 78.42,2.22 78.42,13.97 77.47,14.92 77.47,16.83 IC5.10 76.83,17.14 76.52,17.14 65.41,28.26 65.41,30.8 IC4.7 | LED6.K 38.42,97.79 47.62,97.79 LED5.K 47.94,97.79 56.52,97.79 LED4.K | v69.53,69.85 69.53,66.67 65.09,62.23 65.09,60.01 IC3.7 | 45.4,45.09 50.48,45.09 52.7,42.86 C4.2 | 45.4,45.09 v38.1,45.09 37.15,45.09 34.92,42.86 28.57,42.86 27.94,43.5 26.04,43.5 C2.2 | X6.3 8.26,96.2 6.03,96.2 X6.4 5.71,95.89 3.81,93.98 3.81,84.45 C5.- | IC1.7 38.73,60.33 38.73,64.77 40.32,66.36 40.32,69.22 37.15,72.39 25.72,72.39 C1.2 | v45.4,38.1 38.73,31.43 IC2.7 | v45.4,44.45 45.4,45.09
  Bottom 0.889: v43.5,30.8 43.18,31.11 38.73,31.11 IC2.7 | v81.92,30.48 81.92,20.95 78.11,17.14 77.47,17.14 IC5.10 | 59.69,79.69 65.09,85.09 65.09,88.9 | 59.69,79.69 53.02,73.03 53.02,72.39 C3.2 | 65.09,95.89 65.09,88.9 | 65.09,95.89 66.67,97.47 LED3.K 67.31,97.79 75.88,97.79 LED2.K 76.52,97.79 85.09,97.79 LED1.K | 59.69,79.69 v69.53,69.85 | 65.09,88.9 71.44,88.9 72.39,87.95 72.39,87.31 81.92,77.79 81.92,76.2 C6.2 | LED4.K 56.83,97.47 63.18,97.47 64.77,95.89 65.09,95.89 | 25.72,95.25 25.72,72.71 C1.2 | 25.72,95.25 27.94,97.47 LED7.K 28.57,97.79 38.1,97.79 LED6.K | 25.72,95.25 25.4,95.25 22.86,97.79 19.05,97.79 LED8.K 18.73,97.79 14.29,93.34 10.16,93.34 8.57,94.93 8.57,95.89 X6.3 | v38.1,45.09 38.1,53.02 38.42,53.34 38.42,60.01 IC1.7 | v45.4,44.45 v45.4,38.1
  pour Bottom (isolate 16): -0.6,100.4 100.85,100.4 100.85,72.2 100.85,-1.05 -0.55,-1.05 -0.6,-1.05
N$35
  Top 0.635: R1.1 89.85,90.49 85.09,95.25 LED1.A
N$36
  Top 0.635: LED2.A 76.2,95.25 76.2,91.44 80.64,87 R2.1
N$37
  Top 0.635: R3.1 71.75,90.81 71.12,90.81 66.99,94.93 LED3.A
N$38
  Top 0.635: LED4.A 56.83,94.93 56.83,88.9 58.42,87.31 62.23,87.31 R4.1
N$39
  Top 0.635: LED5.A 47.94,94.93 49.21,94.93 53.02,91.12 R5.1
N$40
  Top 0.635: R6.1 44.13,87.63 42.55,89.22 42.23,89.22 38.42,93.03 38.42,94.93 LED6.A
N$41
  Top 0.635: LED8.A 19.05,95.25 19.05,92.39 23.81,87.63 R8.1
N$42
  Top 0.635: R7.1 33.34,90.81 32.38,90.81 28.26,94.93 LED7.A
N$59
  Top 0.635: R16.1 13.97,12.7 13.97,9.53 18.73,4.76 LED16.A
N$60
  Top 0.635: R15.1 21.59,9.21 22.86,9.21 27.3,4.76 LED15.A
N$61
  Top 0.635: LED14.A 36.51,4.76 36.51,7.94 31.75,12.7 R14.1
N$62
  Top 0.635: R13.1 40.32,9.21 40.96,9.21 45.4,4.76 LED13.A
N$63
  Top 0.635: R12.1 49.21,13.34 53.98,8.57 53.98,4.76 LED12.A
N$64
  Top 0.635: R11.1 57.78,9.21 58.42,9.21 62.87,4.76 LED11.A
N$65
  Top 0.635: R10.1 66.67,13.02 71.75,7.94 71.75,4.76 LED10.A
N$66
  Top 0.635: LED9.A 80.96,4.76 81.92,4.76 86.36,9.21 R9.1
OR0  (via drill 0.64)
  Top 0.635: v58.74,11.43 46.67,23.5 46.67,32.7 48.9,34.92 54.61,34.92 57.47,37.78 57.47,38.42 IC4.11 | v73.03,53.34 74.61,51.75 76.83,51.75 IC6.9
  Bottom 0.635: v58.74,11.43 68.26,11.43 70.17,9.53 76.2,9.53 R9.2 | v73.03,53.34 69.53,53.34 57.78,41.59 57.78,38.73 IC4.11
OR0_OUT
  Top 0.635: IC6.11 84.77,49.21 94.93,49.21 X4.8
OR1  (via drill 0.64)
  Top 0.635: v73.66,25.4 65.41,33.66 65.41,38.42 IC4.8
  Bottom 0.635: v73.66,25.4 73.66,15.56 75.88,13.34 76.52,13.34 R10.2 | IC6.8 76.83,53.98 75.88,53.98 72.71,50.8 68.9,50.8 65.41,47.31 65.41,38.73 IC4.8
OR1_OUT
  Top 0.635: IC6.12 84.77,51.75 94.93,51.75 X4.7
OR2  (via drill 0.64)
  Top 0.635: R11.2 67.63,9.53 62.87,14.29 62.87,30.8 IC4.6 62.87,31.11 58.42,35.56 v58.42,36.2
  Bottom 0.635: v58.42,36.2 49.21,36.2 48.26,37.15 48.26,43.5 49.21,44.45 54.29,44.45 66.36,56.52 76.83,56.52 IC6.7
OR2_OUT
  Top 0.635: IC6.13 84.77,54.29 94.93,54.29 X4.6
OR3  (via drill 0.64)
  Top 0.635: IC4.3 55.24,30.8 55.24,17.46 59.05,13.65 R12.2 | v90.17,42.23 88.58,42.23 82.23,48.58 82.23,54.61 77.79,59.05 77.15,59.05 IC6.6
  Bottom 0.635: v90.17,42.23 90.17,17.46 84.14,11.43 70.48,11.43 66.99,14.92 60.64,14.92 59.37,13.65 R12.2
OR3_OUT
  Top 0.635: IC6.14 84.77,56.83 94.93,56.83 X4.5
OR4  (via drill 0.64)
  Top 0.635: v71.44,49.21 71.44,56.83 76.2,61.59 76.83,61.59 IC6.5
  Bottom 0.635: v71.44,49.21 71.44,30.16 50.8,9.53 50.48,9.53 R13.2 | IC3.11 57.47,67.63 57.47,68.26 59.37,70.17 66.99,70.17 68.9,68.26 70.17,68.26 72.71,70.8 72.71,74.61 73.66,75.56 76.52,75.56 79.38,72.71 79.38,63.5 77.79,61.91 77.15,61.91 IC6.5
OR4_OUT
  Top 0.635: IC6.15 84.77,59.37 94.93,59.37 X4.4
OR5  (via drill 0.64)
  Top 0.635: v2.22,77.15 3.17,78.11 14.92,78.11 20.64,83.82 33.34,83.82 35.24,81.92 53.34,81.92 54.61,80.64 55.88,80.64 64.61,71.91 | 64.61,71.91 64.77,71.75 64.77,67.63 IC3.8 | v70.8,71.12 71.12,70.8 71.12,69.85 75.88,65.09 76.2,65.09 76.83,64.45 IC6.4 | v68.26,73.66 66.36,73.66 64.61,71.91
  Bottom 0.635: v2.22,77.15 2.22,29.84 6.03,26.04 20.95,26.04 33.97,13.02 41.59,13.02 R14.2 | v68.26,73.66 v70.8,71.12
OR5_OUT
  Top 0.635: IC6.16 84.77,61.91 94.93,61.91 X4.3
OR6  (via drill 0.64)
  Top 0.635: v40.64,24.13 29.84,13.34 29.84,12.06 31.43,10.48 31.43,9.53 R15.2 | v69.53,49.21 69.53,52.39 62.23,59.69 IC3.6
  Bottom 0.635: v40.64,24.13 61.59,24.13 66.99,29.53 66.99,46.67 v69.53,49.21 | IC6.3 76.83,66.67 74.61,66.67 65.41,57.47 64.45,57.47 62.23,59.69 IC3.6
OR6_OUT
  Top 0.635: IC6.17 84.77,64.45 94.93,64.45 X4.2
OR7  (via drill 0.64)
  Top 0.635: v68.58,44.13 54.93,57.78 54.93,59.69 IC3.3
  Bottom 0.635: v68.58,44.13 68.58,29.21 50.48,11.11 30.8,11.11 29.21,12.7 24.13,12.7 R16.2 | IC6.2 76.83,69.22 74.93,69.22 68.26,62.55 56.83,62.55 54.93,60.64 54.93,60.01 IC3.3
OR7_OUT
  Top 0.635: IC6.18 84.77,66.99 94.93,66.99 X4.1
VCC  (via drill 0.64)
  Top 0.889: 11.75,5.08 13.02,5.08 X5.1 | 11.75,5.08 10.79,5.08 X5.2 | 23.18,41.27 23.18,43.5 C2.1 | 23.18,41.27 23.18,39.05 IC2.14 | 11.75,5.08 11.75,32.38 v12.06,32.7 | 40.01,42.86 37.15,42.86 35.56,41.27 23.18,41.27 | 40.01,42.86 40.96,42.86 41.27,42.55 49.85,42.55 C4.1 | IC1.14 23.18,67.94 23.18,72.39 C1.1 | X6.1 13.34,96.2 11.11,96.2 X6.2 11.43,95.89 6.35,90.81 6.35,84.45 C5.+ | IC6.20 84.45,72.07 77.15,72.07 IC6.1 76.83,72.07 73.34,72.07 72.39,73.03 70.17,73.03 67.63,70.48 67.63,66.99 65.72,65.09 51.44,65.09 49.85,66.67 49.85,67.31 IC3.14 49.53,66.67 47.94,65.09 v45.72,65.09 | v78.42,47.31 79.69,46.04 79.69,44.13 C7.1 | v40.01,43.18 40.01,42.86
  Bottom 0.889: IC4.14 50.16,38.73 50.16,42.55 C4.1 | v12.06,32.7 12.06,34.61 16.19,38.73 23.18,38.73 IC2.14 | C1.1 22.86,72.71 22.86,74.3 13.02,84.14 6.35,84.14 C5.+ | IC5.1 77.47,40.01 77.47,41.59 79.69,43.81 C7.1 80.01,43.5 83.5,40.01 84.77,40.01 IC5.20 | IC3.14 49.85,67.63 49.85,71.75 50.16,72.07 C3.1 | C6.1 79.69,75.88 83.5,72.07 84.45,72.07 IC6.20 83.5,71.75 82.23,70.48 82.23,51.12 v78.42,47.31 | v45.72,65.09 40.32,65.09 | 40.32,65.09 25.4,65.09 23.5,66.99 23.5,67.63 IC1.14 | v40.01,43.18 40.01,58.42 40.32,58.74 40.32,65.09